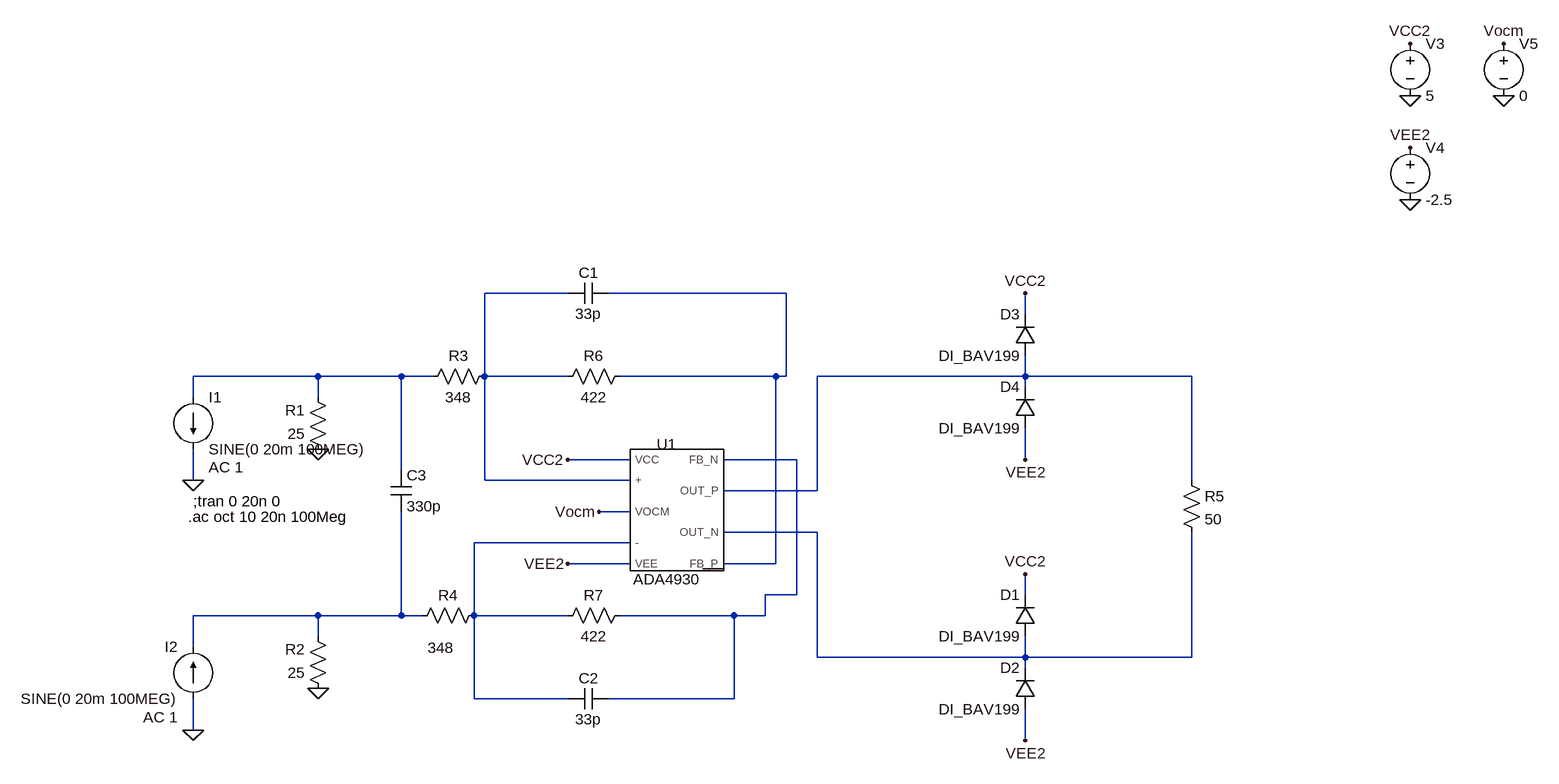
[diagram p0: schematic ada4930_afe.asc]
ada4930_afe.asc, the LTspice schematic file:
Version 4
SHEET 1 1592 680
WIRE 96 -144 -32 -144
WIRE 432 -144 160 -144
WIRE 800 -112 800 -144
WIRE -288 -16 -480 -16
WIRE -160 -16 -288 -16
WIRE -112 -16 -160 -16
WIRE -32 -16 -32 -144
WIRE 96 -16 -32 -16
WIRE 416 -16 176 -16
WIRE 432 -16 432 -144
WIRE 432 -16 416 -16
WIRE 800 -16 800 -48
WIRE 800 -16 480 -16
WIRE 1056 -16 800 -16
WIRE 800 0 800 -16
WIRE -480 16 -480 -16
WIRE -288 16 -288 -16
WIRE 192 112 96 112
WIRE 448 112 336 112
WIRE 800 112 800 64
WIRE -160 128 -160 -16
WIRE -480 144 -480 96
WIRE -32 144 -32 -16
WIRE 192 144 -32 144
WIRE 1056 144 1056 -16
WIRE 480 160 480 -16
WIRE 480 160 336 160
WIRE 192 192 144 192
WIRE 480 224 336 224
WIRE 192 240 -48 240
WIRE 192 272 96 272
WIRE 416 272 416 -16
WIRE 416 272 336 272
WIRE 448 320 448 112
WIRE 448 320 400 320
WIRE 800 320 800 288
WIRE -288 352 -480 352
WIRE -160 352 -160 192
WIRE -160 352 -288 352
WIRE -128 352 -160 352
WIRE -48 352 -48 240
WIRE 96 352 -48 352
WIRE 352 352 176 352
WIRE 400 352 400 320
WIRE 400 352 352 352
WIRE -288 384 -288 352
WIRE -480 400 -480 352
WIRE 480 416 480 224
WIRE 800 416 800 384
WIRE 800 416 480 416
WIRE 1056 416 1056 224
WIRE 1056 416 800 416
WIRE 800 432 800 416
WIRE -48 480 -48 352
WIRE 96 480 -48 480
WIRE 352 480 352 352
WIRE 352 480 160 480
WIRE -480 528 -480 480
WIRE 800 544 800 496
FLAG 1392 -448 0
FLAG 1392 -288 0
FLAG 1392 -528 VCC2
FLAG 1392 -368 VEE2
FLAG 1536 -448 0
FLAG 1536 -528 Vocm
FLAG 96 112 VCC2
FLAG -480 528 0
FLAG -480 144 0
FLAG 96 272 VEE2
FLAG 144 192 Vocm
FLAG -288 464 0
FLAG -288 96 0
FLAG 800 288 VCC2
FLAG 800 544 VEE2
FLAG 800 -144 VCC2
FLAG 800 112 VEE2
SYMBOL AutoGenerated\\ADA4930 240 192 R0
SYMATTR InstName U1
SYMATTR ModelFile C:\Users\Piotr Zdunek\Dropbox\Projects\gk\Fast_Servo\Fast_Servo\Sim\spice\AFE_DAC\ada4930.cir
SYMBOL res -16 -32 R90
WINDOW 0 0 56 VBottom 2
WINDOW 3 32 56 VTop 2
SYMATTR InstName R3
SYMATTR Value 348
SYMBOL res -32 336 R90
WINDOW 0 0 56 VBottom 2
WINDOW 3 50 67 VTop 2
SYMATTR InstName R4
SYMATTR Value 348
SYMBOL voltage 1392 -544 R0
WINDOW 123 0 0 Left 0
WINDOW 39 0 0 Left 0
SYMATTR InstName V3
SYMATTR Value 5
SYMBOL voltage 1392 -384 R0
WINDOW 123 0 0 Left 0
WINDOW 39 0 0 Left 0
SYMATTR InstName V4
SYMATTR Value -2.5
SYMBOL voltage 1536 -544 R0
WINDOW 123 0 0 Left 0
WINDOW 39 0 0 Left 0
SYMATTR InstName V5
SYMATTR Value 0
SYMBOL res 1040 128 R0
SYMATTR InstName R5
SYMATTR Value 50
SYMBOL res 192 -32 R90
WINDOW 0 0 56 VBottom 2
WINDOW 3 32 56 VTop 2
SYMATTR InstName R6
SYMATTR Value 422
SYMBOL res 192 336 R90
WINDOW 0 0 56 VBottom 2
WINDOW 3 32 56 VTop 2
SYMATTR InstName R7
SYMATTR Value 422
SYMBOL res -272 112 R180
WINDOW 0 36 76 Left 2
WINDOW 3 36 40 Left 2
SYMATTR InstName R1
SYMATTR Value 25
SYMBOL res -272 480 R180
WINDOW 0 36 76 Left 2
WINDOW 3 36 40 Left 2
SYMATTR InstName R2
SYMATTR Value 25
SYMBOL current -480 16 R0
WINDOW 123 24 108 Left 2
WINDOW 39 0 0 Left 0
SYMATTR Value2 AC 1
SYMATTR InstName I1
SYMATTR Value SINE(0 20m 100MEG)
SYMBOL current -480 480 R180
WINDOW 0 24 80 Left 2
WINDOW 3 24 0 Left 2
WINDOW 123 24 -28 Left 2
WINDOW 39 0 0 Left 0
SYMATTR InstName I2
SYMATTR Value SINE(0 20m 100MEG)
SYMATTR Value2 AC 1
SYMBOL cap 160 -160 R90
WINDOW 0 0 32 VBottom 2
WINDOW 3 32 32 VTop 2
SYMATTR InstName C1
SYMATTR Value 33p
SYMBOL cap 160 464 R90
WINDOW 0 0 32 VBottom 2
WINDOW 3 32 32 VTop 2
SYMATTR InstName C2
SYMATTR Value 33p
SYMBOL cap -176 128 R0
SYMATTR InstName C3
SYMATTR Value 330p
SYMBOL diode 816 384 R180
WINDOW 0 24 64 Left 2
WINDOW 3 24 0 Left 2
SYMATTR InstName D1
SYMATTR Value DI_BAV199
SYMBOL diode 816 496 R180
WINDOW 0 24 64 Left 2
WINDOW 3 24 0 Left 2
SYMATTR InstName D2
SYMATTR Value DI_BAV199
SYMBOL diode 816 -48 R180
WINDOW 0 24 64 Left 2
WINDOW 3 24 0 Left 2
SYMATTR InstName D3
SYMATTR Value DI_BAV199
SYMBOL diode 816 64 R180
WINDOW 0 24 64 Left 2
WINDOW 3 24 0 Left 2
SYMATTR InstName D4
SYMATTR Value DI_BAV199
TEXT -480 176 Left 2 !;tran 0 20n 0
TEXT -488 200 Left 2 !.ac oct 10 20n 100Meg

The netlist it stands for:
* ada4930_afe.asc
XU1 N005 N002 N001 N007 VCC2 VEE2 N004 N006 Vocm ADA4930  ; pins FB_N FB_P + - VCC VEE OUT_P OUT_N VOCM
R3 N001 N003 348
R4 N007 N008 348
V3 VCC2 0 5
V4 VEE2 0 -2.5
V5 Vocm 0 0
R5 N004 N006 50
R6 N002 N001 422
R7 N005 N007 422
R1 0 N003 25
R2 0 N008 25
I1 N003 0 SINE(0 20m 100MEG) AC 1
I2 0 N008 SINE(0 20m 100MEG) AC 1
C1 N002 N001 33p
C2 N005 N007 33p
C3 N003 N008 330p
D1 N006 VCC2 DI_BAV199
D2 VEE2 N006 DI_BAV199
D3 N004 VCC2 DI_BAV199
D4 VEE2 N004 DI_BAV199
.model D D
.lib standard.dio
;tran 0 20n 0
.ac oct 10 20n 100Meg
.lib C:\Users\Piotr Zdunek\Dropbox\Projects\gk\Fast_Servo\Fast_Servo\Sim\spice\AFE_DAC\ada4930.cir
.backanno
.end